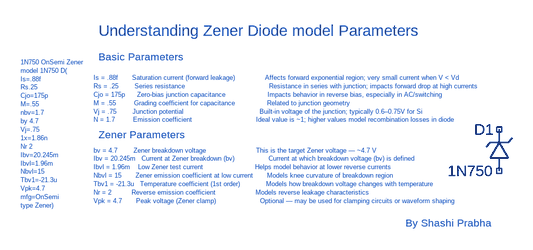
[diagram p0: schematic Understanding Zener Diode model Parameters.asc]
Understanding Zener Diode model Parameters.asc, the LTspice schematic file:
Version 4
SHEET 1 1812 680
SYMBOL zener 304 128 R180
WINDOW 0 24 64 Left 2
WINDOW 3 24 0 Left 2
SYMATTR InstName D1
SYMATTR Value 1N750
SYMATTR Description Diode
SYMATTR Type diode
TEXT -448 -40 Left 0 ;1N750 OnSemi Zener \nmodel 1N750 D(\nIs=.88f \nRs.25 \nCjo=175p \nM=.55 \nnbv=1.7 \nby 4.7 \nVj=.75 \n1x=1.86n \nNr 2 \nIbv=20.245m \nIbvl=1.96m \nNbvl=15 \nTbv1=-21.3u \nVpk=4.7 \nmfg=OnSemi \ntype Zener)
TEXT -336 -16 Left 0 ;Is = .88f       Saturation current (forward leakage)               Affects forward exponential region; very small current when V < Vd\nRs = .25        Series resistance                                          Resistance in series with junction; impacts forward drop at high currents\nCjo = 175p      Zero-bias junction capacitance                     Impacts behavior in reverse bias, especially in AC/switching\nM = .55         Grading coefficient for capacitance                Related to junction geometry\nVj = .75        Junction potential                                      Built-in voltage of the junction; typically 0.6–0.75V for Si\nN = 1.7         Emission coefficient                                Ideal value is ~1; higher values model recombination losses in diode
TEXT -336 96 Left 0 ;bv = 4.7        Zener breakdown voltage                         This is the target Zener voltage — ~4.7 V\nIbv = 20.245m   Current at Zener breakdown (bv)                 Current at which breakdown voltage (bv) is defined\nIbvl = 1.96m    Low Zener test current                          Helps model behavior at lower reverse currents\nNbvl = 15       Zener emission coefficient at low current       Models knee curvature of breakdown region\nTbv1 = -21.3u   Temperature coefficient (1st order)             Models how breakdown voltage changes with temperature\nNr = 2          Reverse emission coefficient                    Models reverse leakage characteristics\nVpk = 4.7       Peak voltage (Zener clamp)                      Optional — may be used for clamping circuits or waveform shaping
TEXT -328 -48 Left 1 ;Basic Parameters
TEXT -328 72 Left 1 ;Zener Parameters
TEXT 144 208 Left 1 ;By Shashi Prabha
TEXT -328 -88 Left 2 ;Understanding Zener Diode model Parameters

The netlist it stands for:
* Understanding Zener Diode model Parameters.asc
D1 NC_01 NC_02 1N750
.model D D
.lib standard.dio
* 1N750 OnSemi Zener
* model 1N750 D(
* Is=.88f
* Rs.25
* Cjo=175p
* M=.55
* nbv=1.7
* by 4.7
* Vj=.75
* 1x=1.86n
* Nr 2
* Ibv=20.245m
* Ibvl=1.96m
* Nbvl=15
* Tbv1=-21.3u
* Vpk=4.7
* mfg=OnSemi
* type Zener)
* Is = .88f       Saturation current (forward leakage)               Affects forward exponential region; very small current when V < Vd
* Rs = .25        Series resistance                                          Resistance in series with junction; impacts forward drop at high currents
* Cjo = 175p      Zero-bias junction capacitance                     Impacts behavior in reverse bias, especially in AC/switching
* M = .55         Grading coefficient for capacitance                Related to junction geometry
* Vj = .75        Junction potential                                      Built-in voltage of the junction; typically 0.6–0.75V for Si
* N = 1.7         Emission coefficient                                Ideal value is ~1; higher values model recombination losses in diode
* bv = 4.7        Zener breakdown voltage                         This is the target Zener voltage — ~4.7 V
* Ibv = 20.245m   Current at Zener breakdown (bv)                 Current at which breakdown voltage (bv) is defined
* Ibvl = 1.96m    Low Zener test current                          Helps model behavior at lower reverse currents
* Nbvl = 15       Zener emission coefficient at low current       Models knee curvature of breakdown region
* Tbv1 = -21.3u   Temperature coefficient (1st order)             Models how breakdown voltage changes with temperature
* Nr = 2          Reverse emission coefficient                    Models reverse leakage characteristics
* Vpk = 4.7       Peak voltage (Zener clamp)                      Optional — may be used for clamping circuits or waveform shaping
* Basic Parameters
* Zener Parameters
* By Shashi Prabha
* Understanding Zener Diode model Parameters
.backanno
.end